# EasyEDA Pro project Esp32TRACK.eprj

# Schematic Schematic1

## Sheets
1 P1: Create Date: 2022-07-31; Page Name: P1; Project Name: Esp32TRACK; Schematic Name: Schematic1; Update Date: 2022-08-05
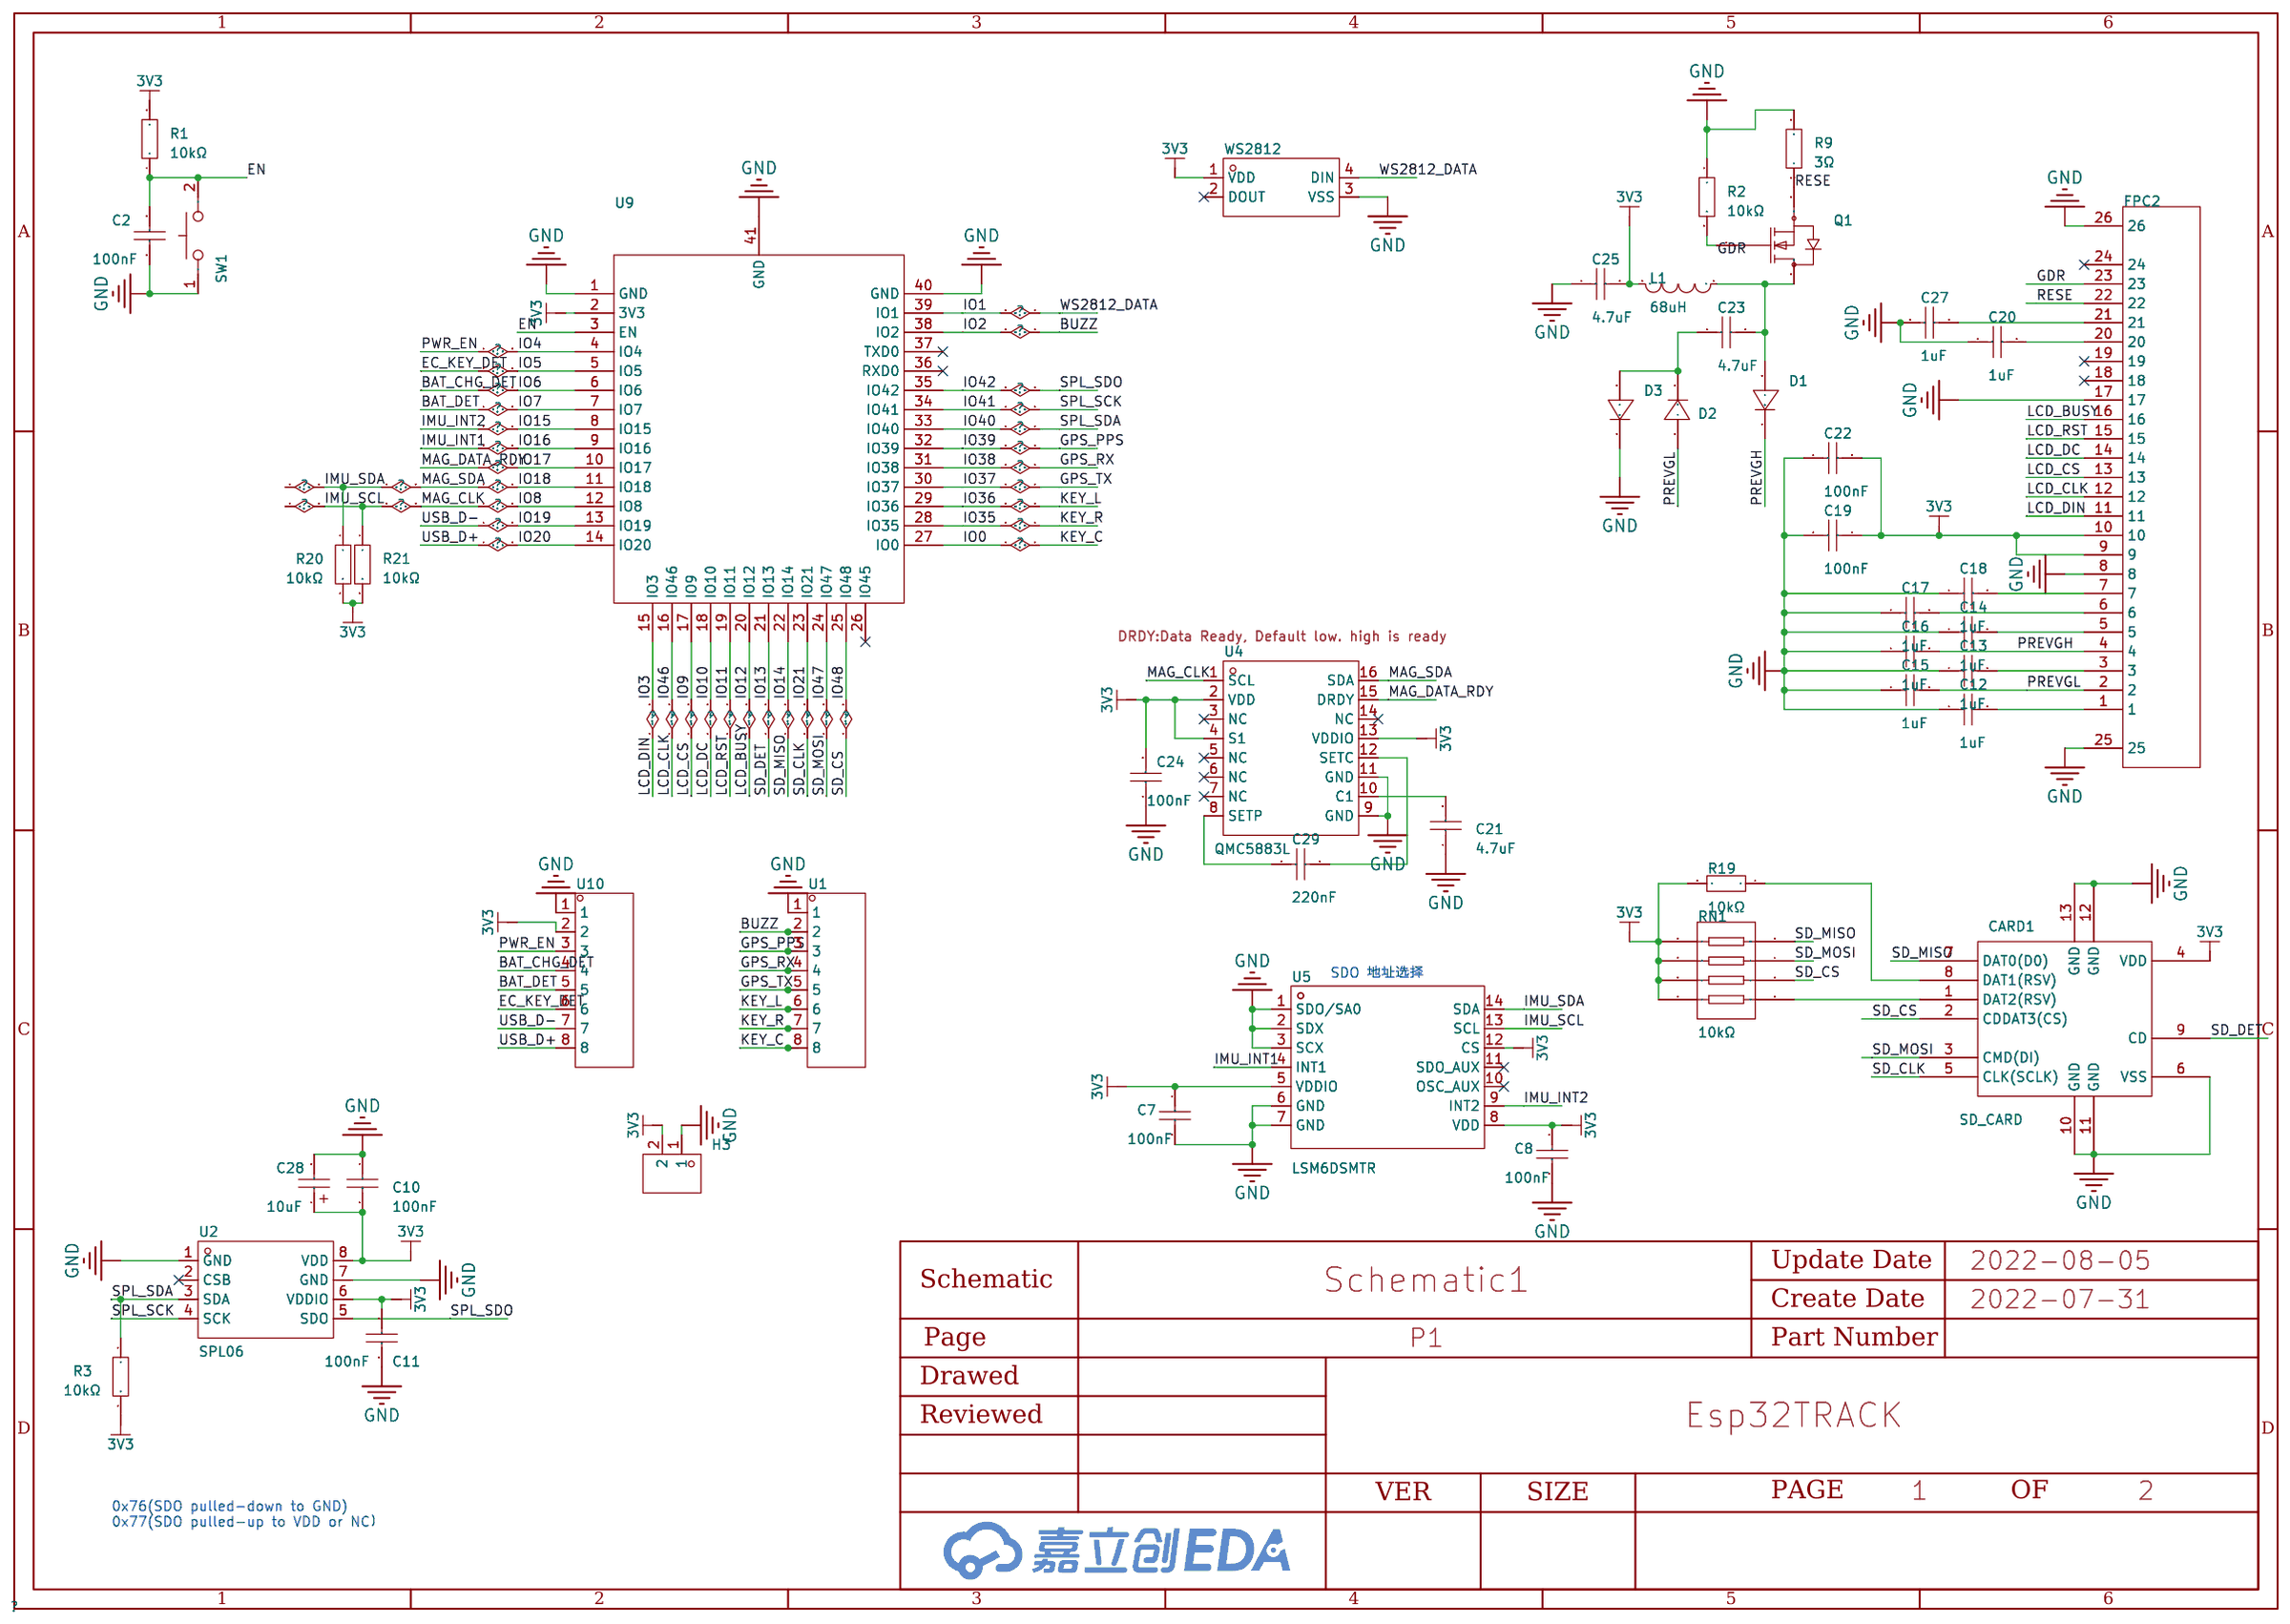
[diagram p0: P1]
2 P2: Create Date: 2022-08-02; Page Name: P2
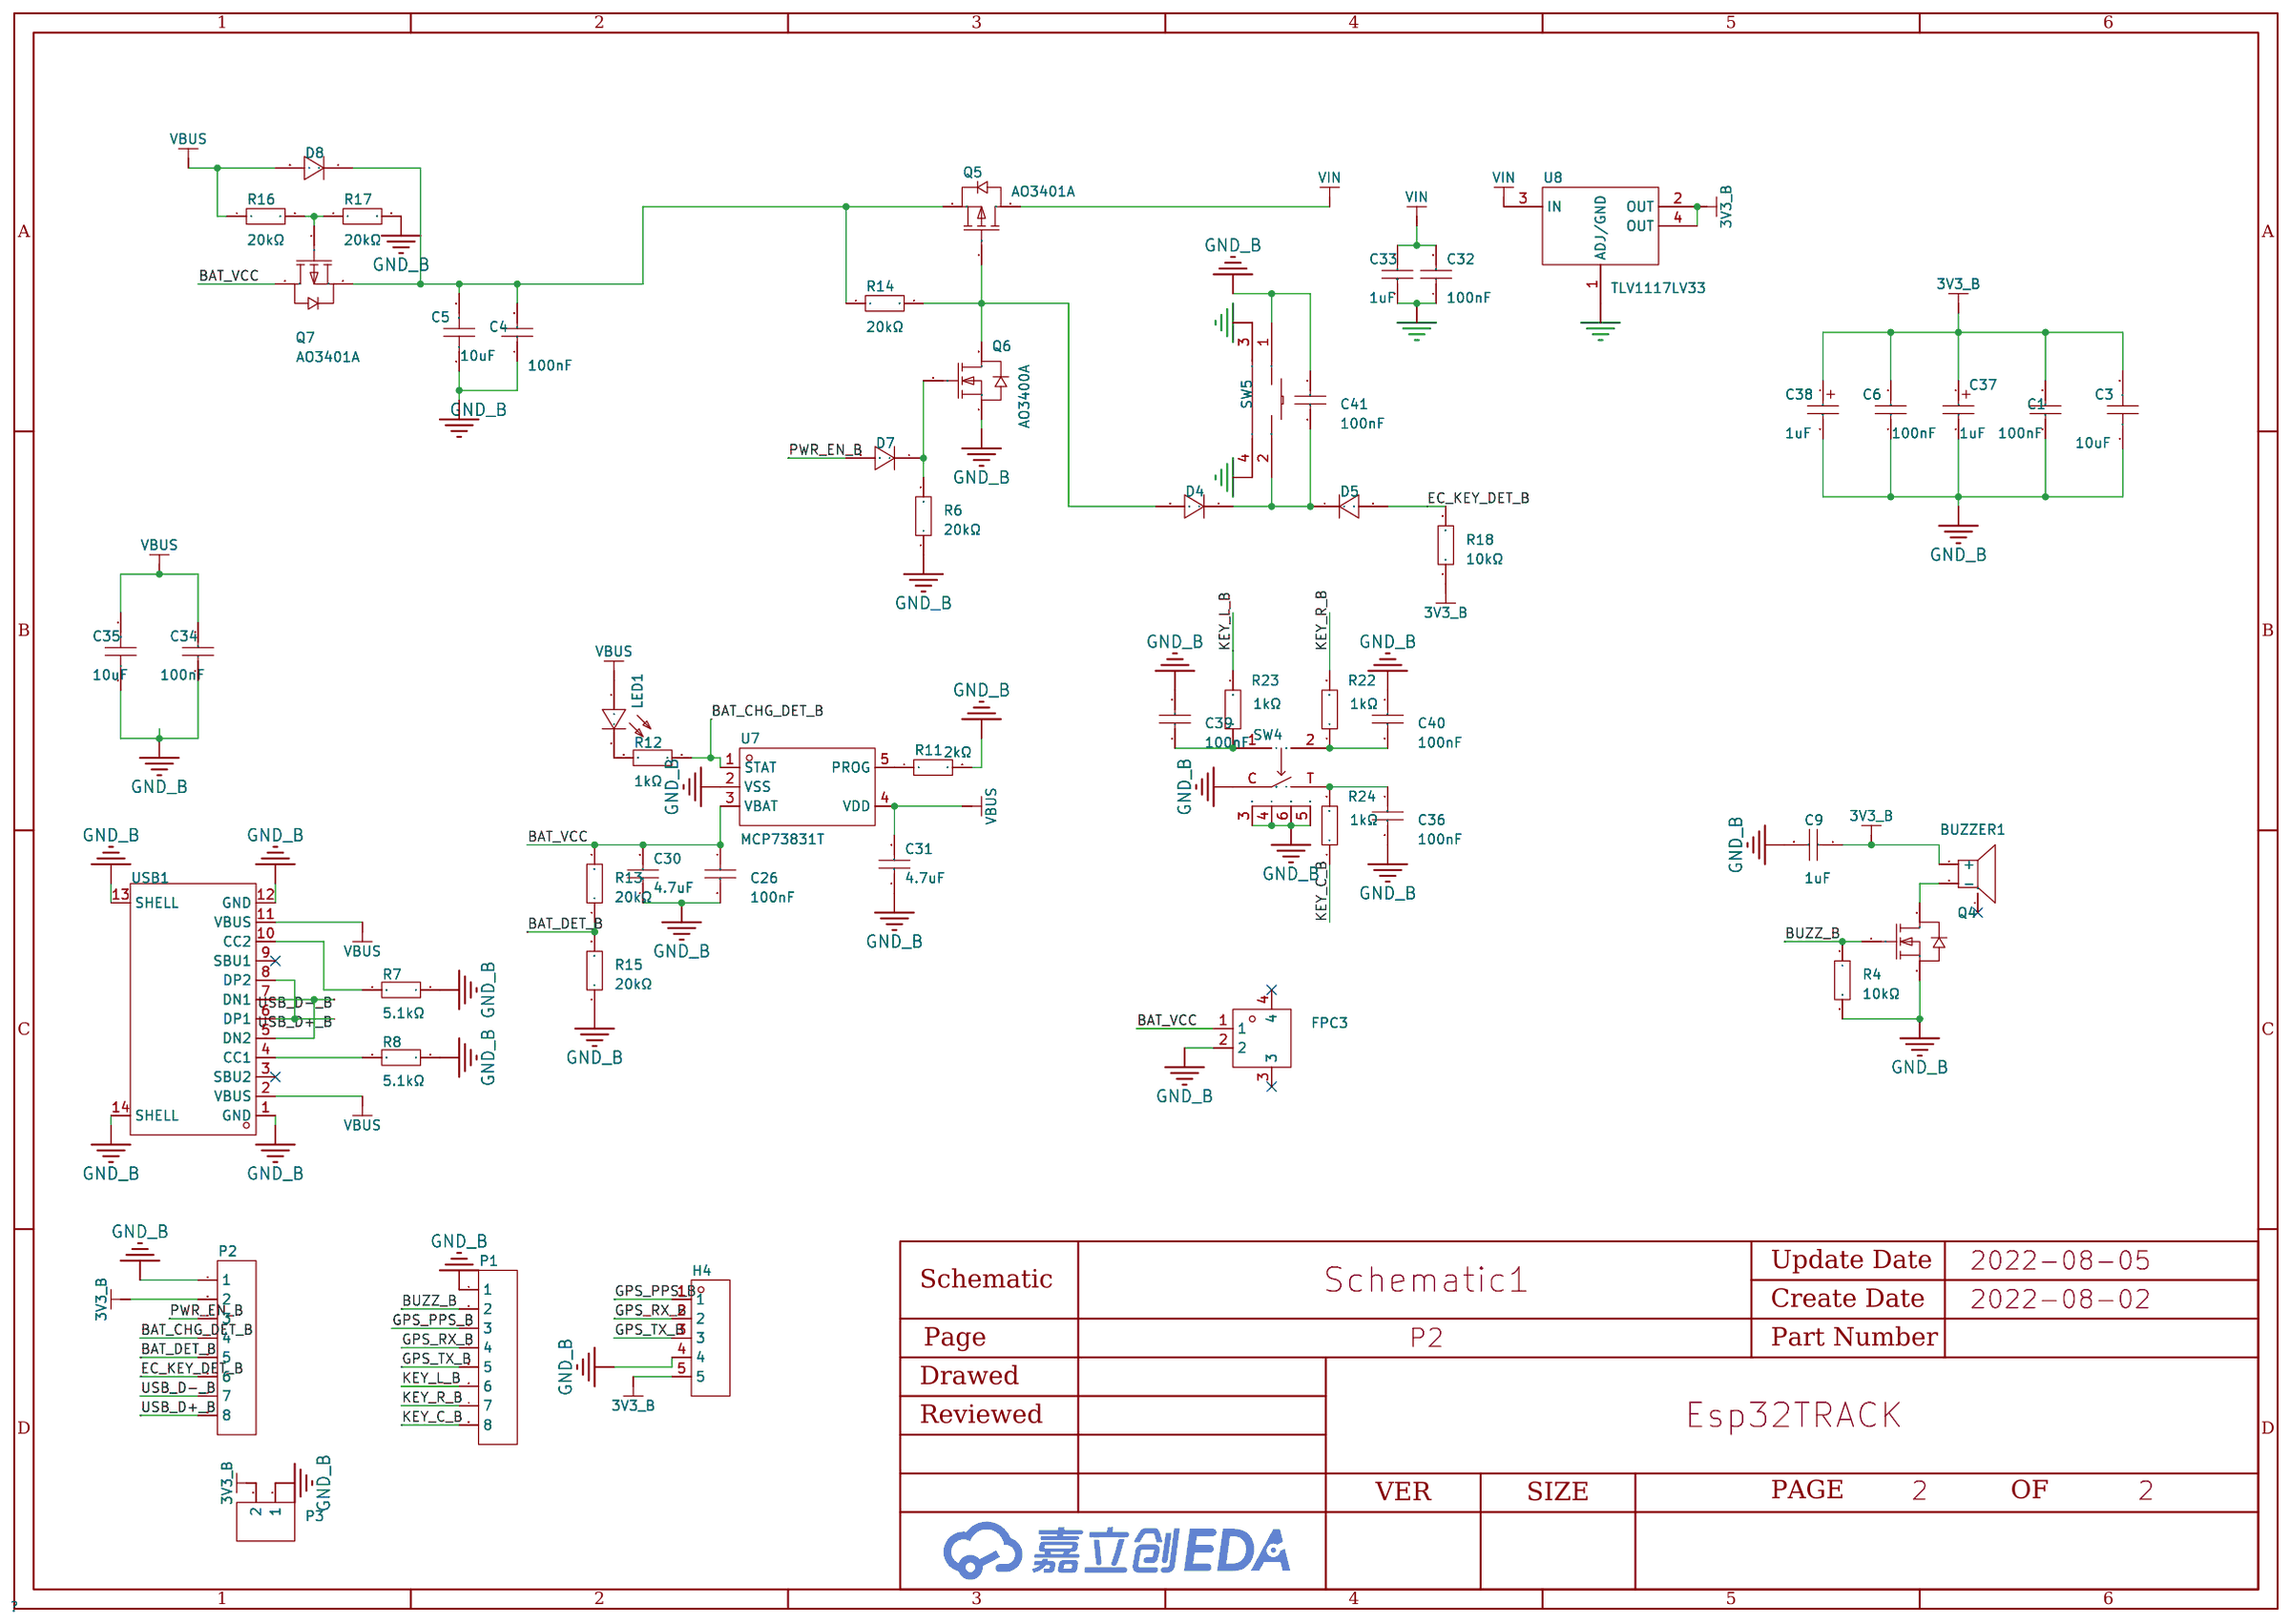
[diagram p1: P2]

## Parts
sheet P1
C2  100nF  [C0603]
C7  100nF  [C0603]
C8  100nF  [C0603]
C10  100nF  [C0603]
C11  100nF  [C0603]
C12  1uF  [C0603]
C13  1uF  [C0603]
C14  1uF  [C0603]
C15  1uF  [C0603]
C16  1uF  [C0603]
C17  1uF  [C0603]
C18  1uF  [C0603]
C19  100nF  [C0603]
C20  1uF  [C0603]
C21  4.7uF  [C0603]
C22  100nF  [C0603]
C23  4.7uF  [C0603]
C24  100nF  [C0603]
C25  4.7uF  [C0603]
C27  1uF  [C0603]
C28  10uF  [CAP-SMD_L3.2-W1.6-RD-C7171]
C29  220nF  [C0603]
CARD1  SD_CARD  [TF-SMD_TF-01A]
D1  -  [SOD-123_L2.8-W1.8-LS3.7-RD]
D2  -  [SOD-123_L2.8-W1.8-LS3.7-RD]
D3  -  [SOD-123_L2.8-W1.8-LS3.7-RD]
FPC2  -  [FPC-SMD_AFC07-S24ECA-00]
H3  -  [HDR-TH_2P-P2.54-V-M]
L1  68uH  [IND-SMD_L5.0-W5.0-P3.60_SMNR5040]
Q1  -  [SOT-323_L2.0-W1.3-P1.30-LS2.1-BR]
R1  10kΩ  [R0603]
R2  10kΩ  [R0603]
R3  10kΩ  [R0603]
R9  3Ω  [R0603]
R19  10kΩ  [R0603]
R20  10kΩ  [R0603]
R21  10kΩ  [R0603]
RN1  10kΩ  [RES-ARRAY-SMD_0603-8P-L3.2-W1.6-BL]
SW1  -  [KEY-SMD_L3.9-W3.0-LS5.0]
U1  -  [HDR-TH_8P-P2.54-V-M]
U2  SPL06  [SENSOR-SMD_SPL06-001]
U4  QMC5883L  [LGA-16_L3.0-W3.0-P0.50-BL_SQ]
U5  LSM6DSMTR  [LGA-14_L3.0-W2.5-P0.50-TL]
U9  -  [WIRELM-SMD_ESP32-S3-WROOM-1U]
U10  -  [HDR-TH_8P-P2.54-V-M]
WS2812  -  [LED-SMD_4P-L3.5-W3.5-TL_WS2812B]
sheet P2
BUZZER1  4000Hz  [BUZ-SMD_3P-L5.2-W5.2-P3.50-BR]
C1  100nF  [C0603]
C3  10uF  [C0603]
C4  100nF  [C0603]
C5  10uF  [C0603]
C6  100nF  [C0603]
C9  1uF  [C0603]
C26  100nF  [C0603]
C30  4.7uF  [C0603]
C31  4.7uF  [C0603]
C32  100nF  [C0603]
C33  1uF  [C0603]
C34  100nF  [C0603]
C35  10uF  [C0603]
C36  100nF  [C0603]
C37  1uF  [CAP-SMD_L3.2-W1.6-RD]
C38  1uF  [CAP-SMD_L3.2-W1.6-RD]
C39  100nF  [C0603]
C40  100nF  [C0603]
C41  100nF  [C0603]
D4  -  [SOD-123F_L2.7-W1.6-LS3.8-RD]
D5  -  [SOD-123F_L2.7-W1.6-LS3.8-RD]
D7  -  [SOD-123F_L2.7-W1.6-LS3.8-RD]
D8  -  [SOD-123F_L2.7-W1.6-LS3.8-RD]
FPC3  -  [CONN-SMD_2P-P1.25_DEALON_1.25-2PWB]
H4  -  [HDR-TH_5P-P2.54-V-M]
LED1  -  [LED0603-FD]
P1  -  [HDR-TH_8P-P2.54-V-F-1]
P2  -  [HDR-TH_8P-P2.54-V-F-1]
P3  -  [HDR-TH_2P-P2.54-V-F]
Q4  -  [SOT-23-3_L2.9-W1.3-P1.90-LS2.4-BR]
Q5  AO3401A  [SOT-23_L2.9-W1.3-P1.90-LS2.4-BR]
Q6  AO3400A  [SOT-23-3_L2.9-W1.6-P1.90-LS2.8-BR]
Q7  AO3401A  [SOT-23_L2.9-W1.3-P1.90-LS2.4-BR]
R4  10kΩ  [R0603]
R6  20kΩ  [R0603]
R7  5.1kΩ  [R0603]
R8  5.1kΩ  [R0603]
R11  2kΩ  [R0603]
R12  1kΩ  [R0603]
R13  20kΩ  [R0603]
R14  20kΩ  [R0603]
R15  20kΩ  [R0603]
R16  20kΩ  [R0603]
R17  20kΩ  [R0603]
R18  10kΩ  [R0603]
R22  1kΩ  [R0603]
R23  1kΩ  [R0603]
R24  1kΩ  [R0603]
SW4  -  [SW-SMD_TM-2023-1]
SW5  -  [KEY-SMD_K2-1806SA-AXXW-XX]
U7  MCP73831T  [SOT-23-5_L3.0-W1.7-P0.95-LS2.8-BR]
U8  TLV1117LV33  [SOT-223_L6.7-W3.5-P2.30-BR]
USB1  -  [USB-C-SMD_TYPE-C-6PIN-2MD-073]

## Library data of the parts
C1 C2 C4 C6-C8 C10 C11 C19 C22 C24 C26 C32 C34 C36 C39-C41 = 0603B104K500NT: 容值:100nF;精度:±10%;额定电压:50V;温度系数:X7R;; LCSC Part Name: 100nF ±10% 50V; Supplier Part: C30926; Manufacturer: FH(风华); Supplier Footprint: 0603; JLCPCB Part Class: Extended Part; Datasheet: https://atta.szlcsc.com/upload/public/pdf/source/20170923/C30926_1506149436298988724.pdf; Supplier: LCSC; Tolerance: ±10%; Voltage Rated: 50V; Temperature Coefficient: X7R
C12-C18 C20 C27 = CL10A105KB8NNNC: 容值:1uF;精度:±10%;额定电压:50V;温度系数:X5R;; LCSC Part Name: 1uF ±10% 50V; Supplier Part: C15849; Manufacturer: SAMSUNG(三星); Supplier Footprint: 0603; JLCPCB Part Class: Basic Part; Datasheet: https://atta.szlcsc.com/upload/public/pdf/source/20160103/1457707679084.pdf; Supplier: LCSC; Tolerance: ±10%; Voltage Rated: 50V; Temperature Coefficient: X5R
C21 C23 C25 C30 C31 = CL10A475KA8NQNC: 温度系数:X5R;额定电压:25V;精度:±10%;容值:4.7uF;; LCSC Part Name: 4.7uF(475) ±10% 25V; Supplier Part: C69335; Manufacturer: SAMSUNG(三星); Supplier Footprint: 0603; JLCPCB Part Class: Extended Part; Datasheet: https://atta.szlcsc.com/upload/public/pdf/source/20161108/1478586410580.pdf; Supplier: LCSC; Temperature Coefficient: X5R; Voltage Rated: 25V; Tolerance: ±10%
C28 = TAJA106K016RNJ: 容值:10uF;精度:±10%;额定电压:16V;等效串联电阻:3Ω@100kHz;工作温度:-55~+125;; LCSC Part Name: 10uF ±10% 16V; Supplier Part: C7171; Manufacturer: Kyocera AVX; Supplier Footprint: CASE-A_3216; JLCPCB Part Class: Basic Part; Datasheet: https://atta.szlcsc.com/upload/public/pdf/source/20160107/1457707748093.pdf; Supplier: LCSC; Tolerance: ±10%; Rated Voltage: 16V; Equivalent Series Resistance(ESR): 3Ω@100kHz; Operating Temperature: -55~+125
C29 = 0603B224K250NT: 容值:220nF;精度:±10%;额定电压:25V;温度系数:X7R;; LCSC Part Name: 220nF ±10% 25V; Supplier Part: C1606; Manufacturer: FH(风华); Supplier Footprint: 0603; JLCPCB Part Class: Extended Part; Datasheet: https://atta.szlcsc.com/upload/public/pdf/source/20170923/C1606_1506149289977988406.pdf; Supplier: LCSC; Tolerance: ±10%; Voltage Rated: 25V; Temperature Coefficient: X7R
CARD1 = TF-01A: 卡连接方式:自弹式;卡类型:MicroSD卡(TF卡);连接器类型:卡座;本体最大高度:-;触头材质:-;触头镀层:-;工作温度范围:-;焊接温度(最大值):-;; LCSC Part Name: 自弹式 MicroSD卡(TF卡) 卡座; Supplier Part: C91145; Manufacturer: 韩国韩荣; Supplier Footprint: SMD; JLCPCB Part Class: Extended Part; Datasheet: https://atta.szlcsc.com/upload/public/pdf/source/20190322/C91145_63CBD6FB4639A3A3EC6A9721F18AE0FB.pdf; Supplier: LCSC; Card Connection Mode: 自弹式; Card Type: MicroSD卡(TF卡); Connector Type: 卡座
D1-D3 = MBR0530: 二极管配置:-;直流反向耐压(Vr):30V;平均整流电流(Io):500mA;正向压降(Vf):550mV@500mA;反向电流(Ir):-;; LCSC Part Name: 30V 500mA 550mV@500mA; Supplier Part: C77336; Manufacturer: CJ（江苏长电/长晶）; Supplier Footprint: SOD-123; JLCPCB Part Class: Extended Part; Datasheet: https://atta.szlcsc.com/upload/public/pdf/source/20160702/1467448303324.pdf; Supplier: LCSC; Reverse Voltage (Vr): 30V; Average Rectified Current (Io): 500mA; Forward Voltage (Vf@If): 550mV@500mA
FPC2 = AFC07-S24ECA-00: 间距:0.5mm;触点数量:24;锁定特性:抽屉式;安装类型:卧贴;触点类型:上接;; LCSC Part Name: 0.5mm P数:24 抽屉式 上接; Supplier Part: C262643; Manufacturer: JS(钜硕电子); Supplier Footprint: SMD,P=0.5mm; JLCPCB Part Class: Extended Part; Datasheet: https://atta.szlcsc.com/upload/public/pdf/source/20180810/C262643_A165FE49097C78A84A50B150AB79460D.pdf; Supplier: LCSC; Pitch: 0.5mm; Number of Contacts: 24; Locking Feature: 抽屉式; Mounting Type: 卧贴; Contact Type: 上接; Height Above Board: 2mm; FFC, FCB Thickness: 0.3mm
H3 = PZ254V-11-02P: 间距:2.54mm;总PIN位数:2;排数:1;插针结构:-;行距:-;安装类型:直插;圆针/方针:-;额定电流:-;额定电压:-;配合针长度:-;塑高:-;触头材质:黄铜;触头镀层:-;颜色:黑色;; LCSC Part Name: 2.54mm; Supplier Part: C492401; Manufacturer: XFCN(台湾兴飞); Supplier Footprint: 插件,P=2.54mm; JLCPCB Part Class: Extended Part; Datasheet: https://atta.szlcsc.com/upload/public/pdf/source/20200309/C492401_A812433581A9B211A7FFA413ADDFF0E5.pdf; Supplier: LCSC; Pitch: 2.54mm; Number of Pins: 2; Number of Rows: 1; Mounting Type: 直插; Contact Material: 黄铜; Color: 黑色
L1 = SWPA5040S680MT: 精度:±20%;直流电阻(DCR):520mΩ;电感值:68uH;额定电流:800mA;; LCSC Part Name: 68uH ±20%; Supplier Part: C86662; Manufacturer: Sunlord(顺络); Supplier Footprint: SMD; JLCPCB Part Class: Extended Part; Datasheet: https://atta.szlcsc.com/upload/public/pdf/source/20170302/1488422689437.pdf; Supplier: LCSC; Length: 5mm; Tolerance: ±20%; Height: 4mm; Width: 5mm; DC Resistance (DCR): 520mΩ; Rated Current: 800mA
Q1 = SI1308EDL: Supplier Part: C4355112; Manufacturer: VBsemi(台湾微碧); Supplier Footprint: SC70-3; JLCPCB Part Class: Extended Part; Datasheet: https://atta.szlcsc.com/upload/public/pdf/source/20220712/F86E3BB2906D071183C948CFEAB36F2B.pdf; Supplier: LCSC
R1-R4 R18-R21 = RC0603JR-0710KL: 电阻类型:厚膜电阻;阻值:10kΩ;精度:±5%;功率:100mW;温度系数:±100ppm/;最大工作电压:75V;工作温度范围:-55~+125;; LCSC Part Name: 10kΩ ±5% 100mW; Supplier Part: C99198; Manufacturer: YAGEO(国巨); Supplier Footprint: 0603; JLCPCB Part Class: Extended Part; Datasheet: https://atta.szlcsc.com/upload/public/pdf/source/20181223/C99198_917934A193F41F77D9F7D214A8C79116.pdf; Supplier: LCSC; Type: 厚膜电阻; Tolerance: ±5%; Power(Watts): 100mW; Temperature Coefficient: ±100ppm/; Overload Voltage (Max): 75V; Operating Temperature Range: -55~+125
R9 = RM06JTN3R0: 电阻类型:厚膜电阻;阻值:3Ω;精度:±5%;功率:1/10W;温度系数:±400ppm/;最大工作电压:75V;工作温度范围:-55~+155;; LCSC Part Name: 3Ω ±5%; Supplier Part: C167056; Manufacturer: 台湾大毅; Supplier Footprint: 0603; JLCPCB Part Class: Extended Part; Datasheet: https://atta.szlcsc.com/upload/public/pdf/source/20180111/C167056_15156385904981255465.pdf; Supplier: LCSC; Type: 厚膜电阻; Tolerance: ±5%; Power(Watts): 1/10W; Temperature Coefficient: ±400ppm/; Overload Voltage (Max): 75V; Operating Temperature Range: -55~+155
RN1 = YC164-JR-0710KL: 阻值:10kΩ;单个元件功率:62.5mW;电阻器数:4;引脚数:8;; LCSC Part Name: 10kΩ ±5% 0603x4; Supplier Part: C107374; Manufacturer: YAGEO(国巨); Supplier Footprint: 1206; JLCPCB Part Class: Extended Part; Datasheet: https://atta.szlcsc.com/upload/public/pdf/source/20170418/1492506324305.pdf; Supplier: LCSC; Power(Watts): 62.5mW; Number of Resistors: 4; Number of Pins: 8
SW1 = SKRKAEE020: 触点电流:50mA;额定电压(DC):12V;电路结构:单刀单掷;安装方式:立贴;按钮形状:圆形按钮;带灯:-;开关长度:3.9mm;开关宽度:2.9mm;开关高度:2mm;; LCSC Part Name: 3.9*2.9*2，1.57N; Supplier Part: C115357; Manufacturer: ALPSALPINE(阿尔卑斯阿尔派); Supplier Footprint: SMD; JLCPCB Part Class: Extended Part; Datasheet: https://atta.szlcsc.com/upload/public/pdf/source/20170620/1497944814772.pdf; Supplier: LCSC; Contact Current: 50mA; Voltage Rating (DC): 12V; Circuit: 单刀单掷; Mounting Style: 立贴; Actuator Style: 圆形按钮; Switch Length: 3.9mm; Switch Width: 2.9mm; Switch Height: 2mm
U1 U10 = Z-211-0811-0021-001: 间距:2.54mm;总PIN位数:8;排数:1;插针结构:1x8P;行距:-;安装类型:直插;圆针/方针:方针;额定电流:-;额定电压:-;配合针长度:6mm;塑高:2.5mm;端接针长度:3mm;触头材质:黄铜;触头镀层:-;工作温度范围:-25~+105;颜色:黑色;; LCSC Part Name: 2.54mm 1x8P; Supplier Part: C190820; Manufacturer: Nextron(台湾正凌); Supplier Footprint: 插件,P=2.54mm; JLCPCB Part Class: Extended Part; Datasheet: https://atta.szlcsc.com/upload/public/pdf/source/20180525/C190820_686788E98164DB7F14582F9FE3B4A39E.pdf; Supplier: LCSC; Pitch: 2.54mm; Number of Pins: 8; Number of Rows: 1; Pin Structure: 1x8P; Mounting Type: 直插; Circluar Pins/Square Pins: 方针; Length of Mating Pin: 6mm; Insulation Height: 2.5mm; Length of End Connection Pin: 3mm; Contact Material: 黄铜; Operating Temperature Range: -25~+105; Color: 黑色
U2 = SPL06-001: LCSC Part Name: 普通气压传感器; Supplier Part: C2684428; Manufacturer: Goertek(歌尔); Supplier Footprint: SMD,2.5x2.0x0.95mm; JLCPCB Part Class: Extended Part; Datasheet: https://atta.szlcsc.com/upload/public/pdf/source/20210120/C2684428_7EA58BBCA3793458F617124FBE4BF8F1.pdf; Supplier: LCSC
U4 = QMC5883L: DRDY:Data Ready, Default low. high is ready; LCSC Part Name: 三轴磁传感器; Supplier Part: C976032; Manufacturer: QST(上海矽睿); Supplier Footprint: LGA-16(3x3x0.9mm); JLCPCB Part Class: Extended Part; Datasheet: https://atta.szlcsc.com/upload/public/pdf/source/20201217/C976032_5B9A2F3901E175046CBA037B1F18A1F2.pdf; Supplier: LCSC
U5 = LSM6DSMTR: iNEMO惯性模块; Supplier Part: C94048; Manufacturer: ST(意法半导体); Supplier Footprint: LGA-14L; JLCPCB Part Class: Extended Part; Datasheet: https://atta.szlcsc.com/upload/public/pdf/source/20170818/C94048_1503051345473895424.pdf; Supplier: LCSC
U9 = ESP32-S3-WROOM-1U-N8: Supplier Part: C2980297; Manufacturer: ESPRESSIF(乐鑫); Supplier Footprint: 模块; JLCPCB Part Class: Extended Part; Datasheet: https://atta.szlcsc.com/upload/public/pdf/source/20220628/A2AC12B3C87735CAEB7EBE2DBE80936C.pdf; Supplier: LCSC
WS2812 = WS2812B-Mini: 发光颜色:RGB三色;二极管配置:-;透镜颜色:-;主波长:472nm；518nm；622nm;峰值波长:-;色温:-;光通量(25时):-;测试电流:12mA;正向电压(VF):-;发光强度:310mcd；780mcd；215mcd;功率:-;发光角度:-;安装方式:-;工作温度:-;; LCSC Part Name: RGB三色; Supplier Part: C527089; Manufacturer: worldsemi; Supplier Footprint: 3535(mm); JLCPCB Part Class: Extended Part; Datasheet: https://atta.szlcsc.com/upload/public/pdf/source/20190620/C114583_ECCAEB884D1CBA01F5696FFC90F90D84.pdf; Supplier: LCSC; Emitted Color: RGB三色; Dominant Wavelength: 472nm；518nm；622nm; Forward Current: 12mA; Luminous Intensity: 310mcd；780mcd；215mcd
BUZZER1 = MLT-5020: 驱动方式:无源(外部驱动);构造类型:电磁式;频率:4000Hz;长度:5.2mm;宽度:5.2mm;高度:2.5mm;; Supplier Part: C94598; Manufacturer: 华能; Supplier Footprint: SMD; JLCPCB Part Class: Extended Part; Datasheet: https://atta.szlcsc.com/upload/public/pdf/source/20210811/111454390007D221D7259018FB170E62.pdf; Supplier: LCSC; Oscillator Circuit: 无源(外部驱动); Technology Type: 电磁式; Length: 5.2mm; Width: 5.2mm; Height: 2.5mm
C3 C5 C35 = CL10A106MA8NRNC: 容值:10uF;精度:±20%;额定电压:25V;温度系数:X5R;; LCSC Part Name: 10uF ±20% 25V; Supplier Part: C96446; Manufacturer: SAMSUNG(三星); Supplier Footprint: 0603; JLCPCB Part Class: Basic Part; Datasheet: https://atta.szlcsc.com/upload/public/pdf/source/20170325/1490427913016.pdf; Supplier: LCSC; Tolerance: ±20%; Voltage Rated: 25V; Temperature Coefficient: X5R
C9 C33 = CL10A105KA8NNNC: 容值:1uF;精度:±10%;额定电压:25V;温度系数:X5R;; LCSC Part Name: 1uF ±10% 25V; Supplier Part: C5673; Manufacturer: SAMSUNG(三星); Supplier Footprint: 0603; JLCPCB Part Class: Extended Part; Datasheet: https://atta.szlcsc.com/upload/public/pdf/source/20160103/1457707739994.pdf; Supplier: LCSC; Tolerance: ±10%; Voltage Rated: 25V; Temperature Coefficient: X5R
C37 C38 = TAJA105K016RNJ: 容值:1uF;精度:±10%;额定电压:16V;等效串联电阻:-;工作温度:-55~+125;; LCSC Part Name: 1uF ±10% 16V; Supplier Part: C7174; Manufacturer: Kyocera AVX; Supplier Footprint: CASE-A_3216; JLCPCB Part Class: Extended Part; Datasheet: https://atta.szlcsc.com/upload/public/pdf/source/20160107/1457707748219.pdf; Supplier: LCSC; Tolerance: ±10%; Rated Voltage: 16V; Operating Temperature: -55~+125
D4 D5 D7 D8 = 1N4148W: 二极管配置:独立式;功率:400mW;直流反向耐压(Vr):75V;平均整流电流(Io):150mA;正向压降(Vf):1.25V@150mA;反向电流(Ir):1A@75V;反向恢复时间(trr):4ns;工作温度:+150@(Tj);; LCSC Part Name: 75V 150mA 4ns; Supplier Part: C81598; Manufacturer: ST(先科); Supplier Footprint: SOD-123; JLCPCB Part Class: Basic Part; Datasheet: https://atta.szlcsc.com/upload/public/pdf/source/20161024/1477288446905.pdf; Supplier: LCSC; Diode Configuration: 独立式; Power Dissipation: 400mW; Reverse Voltage (Vr): 75V; Average Rectified Current (Io): 150mA; Forward Voltage (Vf@If): 1.25V@150mA; Reverse Leakage Current: 1A@75V; Reverse Recovery Time (trr): 4ns; Operating Temperature: +150@(Tj)
FPC3 = 1.25-2PWB: 参考系列:-;间距:1.25mm;插针结构:1x2P;排数:1;每排PIN数:2;行距:-;公母:公型插针;安装方式:卧贴;额定电流:-;工作温度范围:-40~+85;; LCSC Part Name: 1.25mm 1x2P 卧贴; Supplier Part: C2905009; Manufacturer: DEALON(德艺隆); Supplier Footprint: SMD,P=1.25mm; JLCPCB Part Class: Extended Part; Datasheet: https://atta.szlcsc.com/upload/public/pdf/source/20211025/32B11FCE5054D08D2841E43E3DE676AA.pdf; Supplier: LCSC; Pitch: 1.25mm; Pins Structure: 1x2P; Number of Rows: 1; Number of PINs Per Row: 2; Gender: 公型插针; Mounting Style: 卧贴; Operating Temperature Range: -40~+85
H4 = PZ254V-11-05P: 间距:2.54mm;总PIN位数:5;排数:1;插针结构:1x5P;行距:-;安装类型:直插;圆针/方针:方针;额定电流:-;额定电压:-;配合针长度:6mm;塑高:2.5mm;端接针长度:3mm;触头材质:黄铜;触头镀层:-;工作温度范围:-40~+105;颜色:黑色;; LCSC Part Name: 2.54mm 1x5P 直插 方针; Supplier Part: C492404; Manufacturer: XFCN(兴飞); Supplier Footprint: 直插,P=2.54mm; JLCPCB Part Class: Extended Part; Datasheet: https://atta.szlcsc.com/upload/public/pdf/source/20200309/C492404_E51533260F8710EFF5D4617281164C1D.pdf; Supplier: LCSC; Pitch: 2.54mm; Number of Pins: 5; Number of Rows: 1; Pin Structure: 1x5P; Mounting Type: 直插; Circluar Pins/Square Pins: 方针; Length of Mating Pin: 6mm; Insulation Height: 2.5mm; Length of End Connection Pin: 3mm; Contact Material: 黄铜; Operating Temperature Range: -40~+105; Color: 黑色
LED1 = NCD0603R1: 发光颜色:红灯;; LCSC Part Name: 红灯; Supplier Part: C84263; Manufacturer: 国星光电; Supplier Footprint: 0603; JLCPCB Part Class: Extended Part; Datasheet: https://atta.szlcsc.com/upload/public/pdf/source/20200820/C84263_DABC6A75E58F576973B407FDBA283D60.pdf; Supplier: LCSC; Emitted Color: 红灯
P1 P2 = 2.54-1*8P母环保: 间距:2.54mm;总孔位数:8;排数:1;插孔结构:1x8P;行距:-;安装类型:直插;塑高:-;触头材质:-;触头镀层:-;; LCSC Part Name: 2.54mm; Supplier Part: C27438; Manufacturer: BOOMELE(博穆精密); Supplier Footprint: 插件,P=2.54mm; JLCPCB Part Class: Extended Part; Datasheet: https://atta.szlcsc.com/upload/public/pdf/source/20151109/1457707554453.pdf; Supplier: LCSC; Pitch: 2.54mm; Number of Holes: 8; Number of Rows: 1; Holes Structure: 1x8P; Mounting Type: 直插
P3 = 2.54-1*2P母: 间距:2.54mm;总孔位数:2;排数:1;插孔结构:1x2P;行距:-;安装类型:直插;塑高:-;触头材质:-;触头镀层:-;; LCSC Part Name: 2.54mm; Supplier Part: C49661; Manufacturer: BOOMELE(博穆精密); Supplier Footprint: 插件,P=2.54mm; JLCPCB Part Class: Extended Part; Datasheet: https://atta.szlcsc.com/upload/public/pdf/source/20151109/1457707570988.pdf; Supplier: LCSC; Pitch: 2.54mm; Number of Holes: 2; Number of Rows: 1; Holes Structure: 1x2P; Mounting Type: 直插
Q4 = YJL3400A: 类型:N沟道;漏源电压(Vdss):30V;连续漏极电流(Id):5.6A;功率(Pd):1.2W;导通电阻(RDS(on)@Vgs,Id):27mΩ@10V,5.6A;阈值电压(Vgs(th)@Id):1.5V@250A;; LCSC Part Name: N沟道 30V 5.6A; Supplier Part: C699302; Manufacturer: YANGJIE(扬杰); Supplier Footprint: SOT-23-3L; JLCPCB Part Class: Extended Part; Datasheet: https://atta.szlcsc.com/upload/public/pdf/source/20200709/C699302_C2B88B69139871D2E58BC98BB548FF51.pdf; Supplier: LCSC; Type: N沟道; Drain Source Voltage (Vdss): 30V; Continuous Drain Current (Id): 5.6A; Power Dissipation (Pd): 1.2W; Drain Source On Resistance (RDS(on)@Vgs,Id): 27mΩ@10V,5.6A; Gate Threshold Voltage (Vgs(th)@Id): 1.5V@250A
Q5 Q7 = AO3401A: 类型:P沟道;漏源电压(Vdss):30V;连续漏极电流(Id):4A;功率(Pd):1.4W;导通电阻(RDS(on)@Vgs,Id):44mΩ@10V,4.3A;阈值电压(Vgs(th)@Id):1.3V@250A;; LCSC Part Name: P沟道 30V 4A; Supplier Part: C15127; Manufacturer: AOS; Supplier Footprint: SOT-23-3L; JLCPCB Part Class: Basic Part; Datasheet: https://atta.szlcsc.com/upload/public/pdf/source/20160507/1462613609053.pdf; Supplier: LCSC; Type: P沟道; Drain Source Voltage (Vdss): 30V; Continuous Drain Current (Id): 4A; Power Dissipation (Pd): 1.4W; Drain Source On Resistance (RDS(on)@Vgs,Id): 44mΩ@10V,4.3A; Gate Threshold Voltage (Vgs(th)@Id): 1.3V@250A
Q6 = AO3400A: 类型:N沟道;漏源电压(Vdss):30V;连续漏极电流(Id):5.7A;功率(Pd):1.4W;导通电阻(RDS(on)@Vgs,Id):26.5mΩ@10V,5.7A;阈值电压(Vgs(th)@Id):1.5V@250A;; LCSC Part Name: N沟道 30V 5.7A; Supplier Part: C20917; Manufacturer: AOS; Supplier Footprint: SOT-23-3L; JLCPCB Part Class: Basic Part; Datasheet: https://atta.szlcsc.com/upload/public/pdf/source/20140107/1457706668533.pdf; Supplier: LCSC; Type: N沟道; Drain Source Voltage (Vdss): 30V; Continuous Drain Current (Id): 5.7A; Power Dissipation (Pd): 1.4W; Drain Source On Resistance (RDS(on)@Vgs,Id): 26.5mΩ@10V,5.7A; Gate Threshold Voltage (Vgs(th)@Id): 1.5V@250A
R6 R13-R17 = RC0603FR-0720KL: 电阻类型:厚膜电阻;阻值:20kΩ;精度:±1%;功率:100mW;温度系数:±100ppm/;最大工作电压:75V;工作温度范围:-55~+155;; LCSC Part Name: 20kΩ ±1% 100mW; Supplier Part: C105575; Manufacturer: YAGEO(国巨); Supplier Footprint: 0603; JLCPCB Part Class: Extended Part; Datasheet: https://atta.szlcsc.com/upload/public/pdf/source/20170818/C105575_1503051101353895049.pdf; Supplier: LCSC; Type: 厚膜电阻; Tolerance: ±1%; Power(Watts): 100mW; Temperature Coefficient: ±100ppm/; Overload Voltage (Max): 75V; Operating Temperature Range: -55~+155
R7 R8 = RS-03K5101FT: 精度:±1%;温度系数:±100ppm/;功率:100mW;阻值:5.1kΩ;最大工作电压:50V;工作温度范围:-55~+155;; LCSC Part Name: 5.1KΩ(5101) ±1%; Supplier Part: C156350; Manufacturer: FH(风华); Supplier Footprint: 0603; JLCPCB Part Class: Extended Part; Datasheet: https://atta.szlcsc.com/upload/public/pdf/source/20171221/C156350_15138396756901196077.pdf; Supplier: LCSC; Tolerance: ±1%; Temperature Coefficient: ±100ppm/; Power(Watts): 100mW; Overload Voltage (Max): 50V; Operating Temperature Range: -55~+155
R11 = RC0603FR-072KL: 精度:±1%;阻值:2kΩ;温度系数:±100ppm/;功率:100mW;最大工作电压:75V;工作温度范围:-55~+155;; LCSC Part Name: 2kΩ ±1%; Supplier Part: C105576; Manufacturer: YAGEO(国巨); Supplier Footprint: 0603; JLCPCB Part Class: Extended Part; Datasheet: https://atta.szlcsc.com/upload/public/pdf/source/20170428/1493376739276.pdf; Supplier: LCSC; Tolerance: ±1%; Temperature Coefficient: ±100ppm/; Power(Watts): 100mW; Overload Voltage (Max): 75V; Operating Temperature Range: -55~+155
R12 R22-R24 = RC0603FR-071KL: 精度:±1%;温度系数:±100ppm/;阻值:1kΩ;功率:100mW;最大工作电压:75V;工作温度范围:-55~+155;; LCSC Part Name: 1kΩ ±1%; Supplier Part: C22548; Manufacturer: YAGEO(国巨); Supplier Footprint: 0603; JLCPCB Part Class: Extended Part; Datasheet: https://atta.szlcsc.com/upload/public/pdf/source/20180312/7BD3618A8B6324EA6280B0497A051AB7.pdf; Supplier: LCSC; Tolerance: ±1%; Temperature Coefficient: ±100ppm/; Power(Watts): 100mW; Overload Voltage (Max): 75V; Operating Temperature Range: -55~+155
SW4 = TM-2023: 3挡拨轮开关  音响周边开关 多功能开关上中下按键; LCSC Part Name: 3挡拨轮开关; Supplier Part: C318951; Manufacturer: XKB Connectivity(中国星坤); Supplier Footprint: SMD; JLCPCB Part Class: Extended Part; Datasheet: https://atta.szlcsc.com/upload/public/pdf/source/20211015/4E21B3A9DEF1E687333BA1DF36F89D09.pdf; Supplier: LCSC
SW5 = K2-1806SA-A3DW-04: 触点电流:50mA;额定电压(DC):12V;绝缘电阻:100MΩ;安装方式:卧贴;作用力:180gf@±30gf;机械寿命:100000;工作温度:-25~+85;开关长度:4.8mm;开关宽度:3.55mm;开关高度:1.88mm;; LCSC Part Name: 2x4 小型侧按键 160G; Supplier Part: C2690015; Manufacturer: 韩国韩荣; Supplier Footprint: SMD; JLCPCB Part Class: Extended Part; Datasheet: https://atta.szlcsc.com/upload/public/pdf/source/20201126/C961746_BE85072586CFEF659A466A854D742287.pdf; Supplier: LCSC; Contact Current: 50mA; Voltage Rating (DC): 12V; Insulation Resistance: 100MΩ; Mounting Sytle: 卧贴; Operating Force: 180gf@±30gf; Mechanical Life: 100000; Operating Temperature: -25~+85; Switch Length: 4.8mm; Switch Width: 3.55mm; Switch Height: 1.88mm
U7 = MCP73831T-2ACI/OT: 充电电池的类型:-;电池单元组数:-;最大充电电流:-;充满的电池组电压:-;最大供应电压:-;; Supplier Part: C424093; Manufacturer: MICROCHIP(美国微芯); Supplier Footprint: SOT-23-5; JLCPCB Part Class: Extended Part; Datasheet: https://atta.szlcsc.com/upload/public/pdf/source/20190902/C424093_BB3CBFD6F009A8554318004A07DA97EE.pdf; Supplier: LCSC
U8 = TLV1117LV33DCYR: 输出类型:固定;输出极性:正;输出通道数:1;最大输入电压:5.5V;输出电压:3.3V;压差:1.3V@(800mA);输出电流:1A;电源纹波抑制比(PRSS):75dB@(120Hz);; LCSC Part Name: Vin=5.5V Vout=3.3V 1A 75dB@(120Hz); Supplier Part: C15578; Manufacturer: TI(德州仪器); Supplier Footprint: SOT-223; Datasheet: https://atta.szlcsc.com/upload/public/pdf/source/20140704/1457707105729.pdf; Supplier: LCSC; Output Type: 固定; Output Polarity: 正; Number of Outputs: 1; Maximum Input Voltage: 5.5V; Output Voltage: 3.3V; Dropout Voltage: 1.3V@(800mA); Output Current: 1A; Power Supply Rejection Ratio (PRSS): 75dB@(120Hz)
USB1 = TYPE-C 16PIN 2MD(073): 连接器类型:Type-C;标准:-;公母:母座;触点数量:16;端口数量:1;安装方式:卧贴;额定电流 - 电源:5A;工作温度范围:-25~+85;; LCSC Part Name: Type-C 母座 卧贴 带定位柱 不锈钢外壳 2次模顶; Supplier Part: C2765186; Manufacturer: SHOU HAN(首韩); Supplier Footprint: SMD; JLCPCB Part Class: Extended Part; Datasheet: https://atta.szlcsc.com/upload/public/pdf/source/20211123/39B17C16241EAC15C5E277BDA434118E.pdf; Supplier: LCSC; Connector Type: Type-C; Gender: 母座; Number of Contacts: 16; Number of Ports: 1; Mounting Style: 卧贴; Current Rating - Power (Max): 5A; Operating Temperature Range: -25~+85

## Nets
3V3: C7.1 C8.1 C10.2 C11.1 C19.1 C22.1 C24.2 C25.2 C28.1 CARD1.4(VDD) FPC2.9 FPC2.10 H3.2 L1.2 R1.2 R3.2 R19.2 R20.2 R21.2 RN1.1 RN1.2 RN1.3 RN1.4 U2.6(VDDIO) U2.8(VDD) U4.2(VDD) U4.4(S1) U4.13(VDDIO) U5.5(VDDIO) U5.8(VDD) U5.12(CS) U9.2(3V3) U10.2 WS2812.1(VDD)
3V3_B: BUZZER1.2(+) C1.2 C3.2 C6.2 C9.1 C37.1 C38.1 H4.5 P2.2 P3.2 R18.1 U8.2(OUT) U8.4(OUT)
GND: C2.1 C7.2 C8.2 C10.1 C11.2 C12.1 C13.1 C14.1 C15.1 C16.1 C17.1 C18.1 C19.2 C20.1 C21.1 C22.2 C24.1 C25.1 C27.1 C28.2 CARD1.6(VSS) CARD1.10(GND) CARD1.11(GND) CARD1.12(GND) CARD1.13(GND) D3.1(C) FPC2.8 FPC2.17 FPC2.25 FPC2.26 H3.1 R2.1 R9.2 SW1.1 U1.1 U2.1(GND) U2.7(GND) U4.9(GND) U4.11(GND) U5.1(SDO/SA0) U5.2(SDX) U5.3(SCX) U5.6(GND) U5.7(GND) U9.1(GND) U9.40(GND) U9.41(GND) U10.1 WS2812.3(VSS)
GND_B: C1.1 C3.1 C4.1 C5.1 C6.1 C9.2 C26.2 C30.1 C31.1 C32.1 C33.2 C34.1 C35.1 C36.2 C37.2 C38.2 C39.1 C40.1 C41.1 FPC3.2 H4.4 P1.1 P2.1 P3.1 Q4.2(S) Q6.2(S) R4.2 R6.1 R7.1 R8.1 R11.2 R15.1 R17.2 SW4.3 SW4.4 SW4.5 SW4.6 SW4.C SW5.1 SW5.3 SW5.4 U7.2(VSS) U8.1(ADJ/GND) USB1.1(GND) USB1.12(GND) USB1.13(SHELL) USB1.14(SHELL)
VBUS: C31.2 C34.2 C35.2 D8.2(A) LED1.1(A) R16.1 U7.4(VDD) USB1.2(VBUS) USB1.11(VBUS)
VIN: C32.2 C33.1 Q5.3(D) U8.3(IN)
BAT_CHG_DET: U9.6(IO6) U10.4
BAT_CHG_DET_B: P2.4 R12.1 U7.1(STAT)
BAT_DET: U9.7(IO7) U10.5
BAT_DET_B: P2.5 R13.1 R15.2
BAT_VCC: C26.1 C30.2 FPC3.1 Q7.3(D) R13.2 U7.3(VBAT)
BUZZ: U1.2 U9.38(IO2)
BUZZ_B: P1.2 Q4.1(G) R4.1
EC_KEY_DET: U9.5(IO5) U10.6
EC_KEY_DET_B: D5.2(A) P2.6 R18.2
EN: C2.2 R1.1 SW1.2 U9.3(EN)
GDR: FPC2.23 Q1.1(G) R2.2
GPS_PPS: U1.3 U9.32(IO39)
GPS_PPS_B: H4.1 P1.3
GPS_RX: U1.4 U9.31(IO38)
GPS_RX_B: H4.2 P1.4
GPS_TX: U1.5 U9.30(IO37)
GPS_TX_B: H4.3 P1.5
IMU_INT1: U5.4(INT1) U9.9(IO16)
IMU_INT2: U5.9(INT2) U9.8(IO15)
IMU_SCL: R21.1 U4.1(SCL) U5.13(SCL) U9.12(IO8)
IMU_SDA: R20.1 U4.16(SDA) U5.14(SDA) U9.11(IO18)
IO0: U1.8 U9.27(IO0)
IO1: U9.39(IO1) WS2812.4(DIN)
IO3: FPC2.11 U9.15(IO3)
IO4: U9.4(IO4) U10.3
IO9: FPC2.13 U9.17(IO9)
IO10: FPC2.14 U9.18(IO10)
IO11: FPC2.15 U9.19(IO11)
IO12: FPC2.16 U9.20(IO12)
IO13: CARD1.9(CD) U9.21(IO13)
IO14: CARD1.7(DAT0(D0)) RN1.8 U9.22(IO14)
IO17: U4.15(DRDY) U9.10(IO17)
IO19: U9.13(IO19) U10.7
IO20: U9.14(IO20) U10.8
IO21: CARD1.5(CLK(SCLK)) U9.23(IO21)
IO35: U1.7 U9.28(IO35)
IO36: U1.6 U9.29(IO36)
IO40: R3.1 U2.3(SDA) U9.33(IO40)
IO41: U2.4(SCK) U9.34(IO41)
IO42: U2.5(SDO) U9.35(IO42)
IO46: FPC2.12 U9.16(IO46)
IO47: CARD1.3(CMD(DI)) RN1.7 U9.24(IO47)
IO48: CARD1.2(CDDAT3(CS)) RN1.6 U9.25(IO48)
KEY_C_B: P1.8 R24.1
KEY_L_B: P1.6 R23.2
KEY_R_B: P1.7 R22.2
PREVGH: C16.2 D1.1(C) FPC2.4
PREVGL: C15.2 D2.2(A) FPC2.2
PWR_EN_B: D7.2(A) P2.3
RESE: FPC2.22 Q1.2(S) R9.1
USB_D+_B: P2.8 USB1.6(DP1) USB1.8(DP2)
USB_D-_B: P2.7 USB1.5(DN2) USB1.7(DN1)
$1N11068: CARD1.8(DAT1(RSV)) R19.1
$1N11088: CARD1.1(DAT2(RSV)) RN1.5
$1N15208: C12.2 FPC2.1
$1N15252: C13.2 FPC2.3
$1N15399: C14.2 FPC2.5
$1N16072: C18.2 FPC2.7
$1N16103: C17.2 FPC2.6
$1N18173: C20.2 FPC2.20
$1N18210: C27.2 FPC2.21
$1N21310: C23.2 D1.2(A) L1.1 Q1.3(D)
$1N31026: C23.1 D2.1(C) D3.2(A)
$1N64581: C29.1 U4.8(SETP)
$1N64631: C29.2 U4.12(SETC)
$1N65487: C21.2 U4.10(C1)
$2N577: C4.2 C5.2 D8.1(K) Q5.2(S) Q7.2(S) R14.1
$2N1088: R11.1 U7.5(PROG)
$2N1091: LED1.2(K) R12.2
$2N1913: R7.2 USB1.10(CC2)
$2N1914: R8.2 USB1.4(CC1)
$2N4080: D4.2(A) Q5.1(G) Q6.3(D) R14.2
$2N4943: C41.2 D4.1(K) D5.1(K) SW5.2
$2N5383: D7.1(K) Q6.1(G) R6.2
$2N7967: Q7.1(G) R16.2 R17.1
$2N25957: C36.1 R24.2 SW4.T
$2N25997: C39.2 R23.1 SW4.1
$2N26037: C40.2 R22.1 SW4.2
$2N41653: BUZZER1.3(-) Q4.3(D)

Not connected (* = marked no-connect by the designer): BUZZER1 1(NC)*; FPC2 18* 19* 24*; FPC3 3* 4*; U2 2(CSB)*; U4 3(NC)* 5(NC)* 6(NC)* 7(NC)* 14(NC)*; U5 10(OSC_AUX)* 11(SDO_AUX)*; U9 26(IO45)* 36(RXD0)* 37(TXD0)*; USB1 3(SBU2)* 9(SBU1)*; WS2812 2(DOUT)*

## Notes on the sheets
sheet 1
- SDO 地址选择
- 0x76(SDO pulled-down to GND)
  0x77(SDO pulled-up to VDD or NC）

# Board PCB1
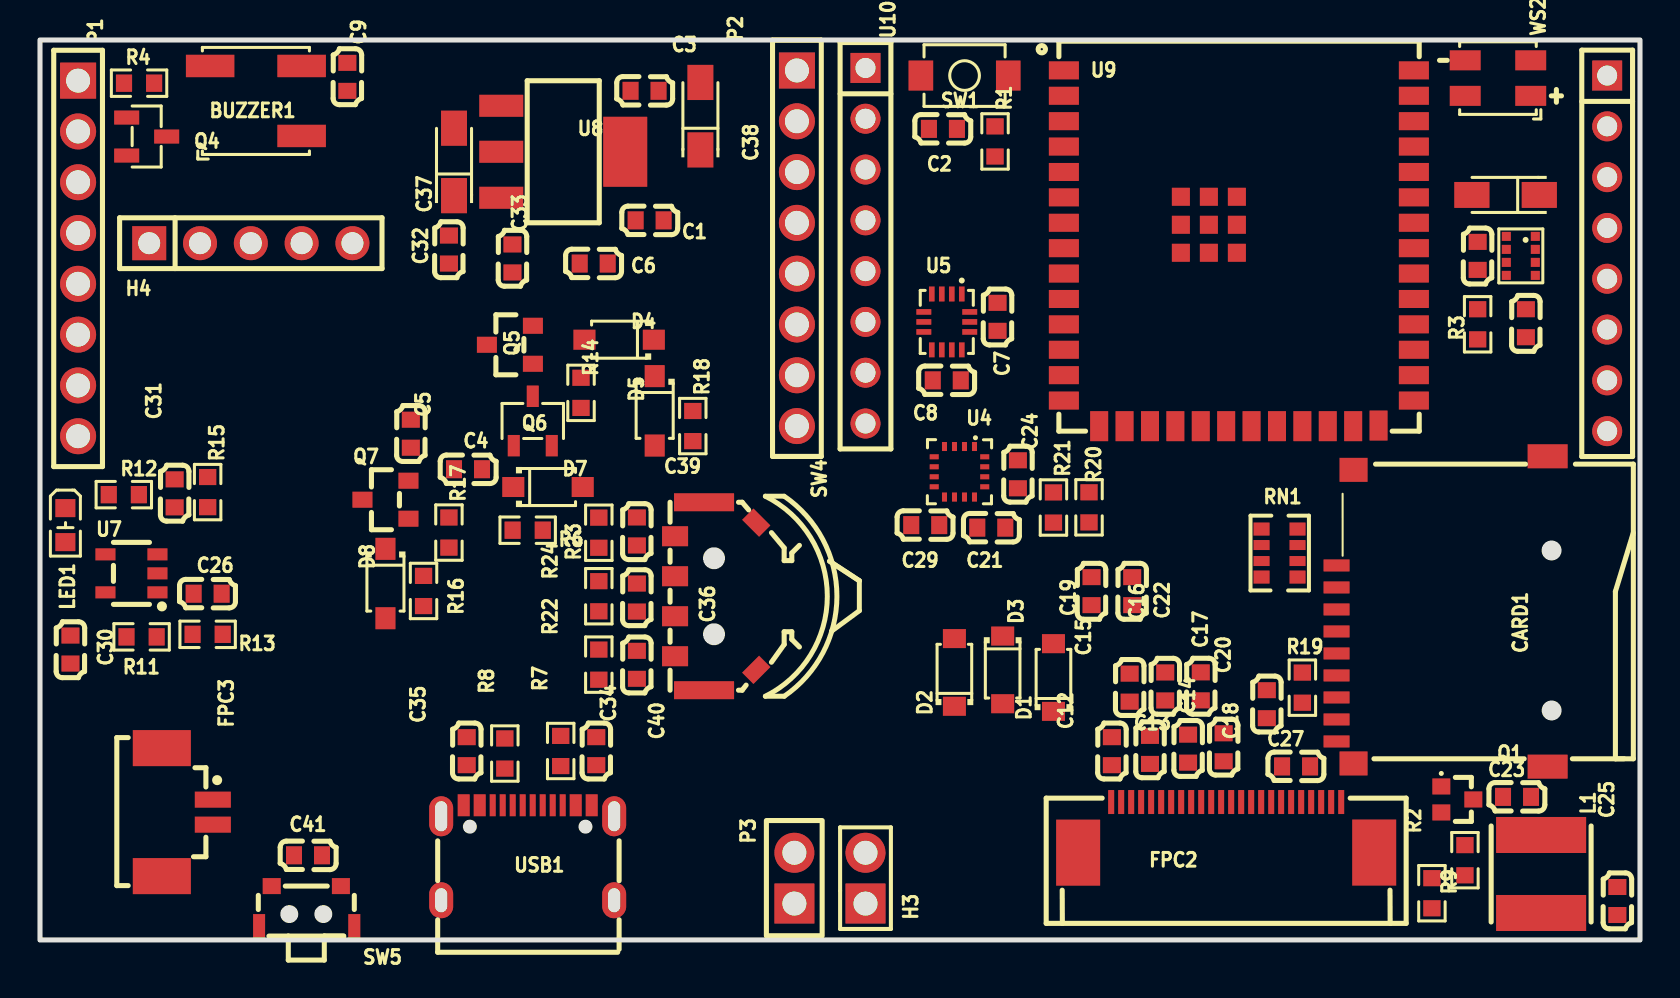
[diagram p2: board, top side]
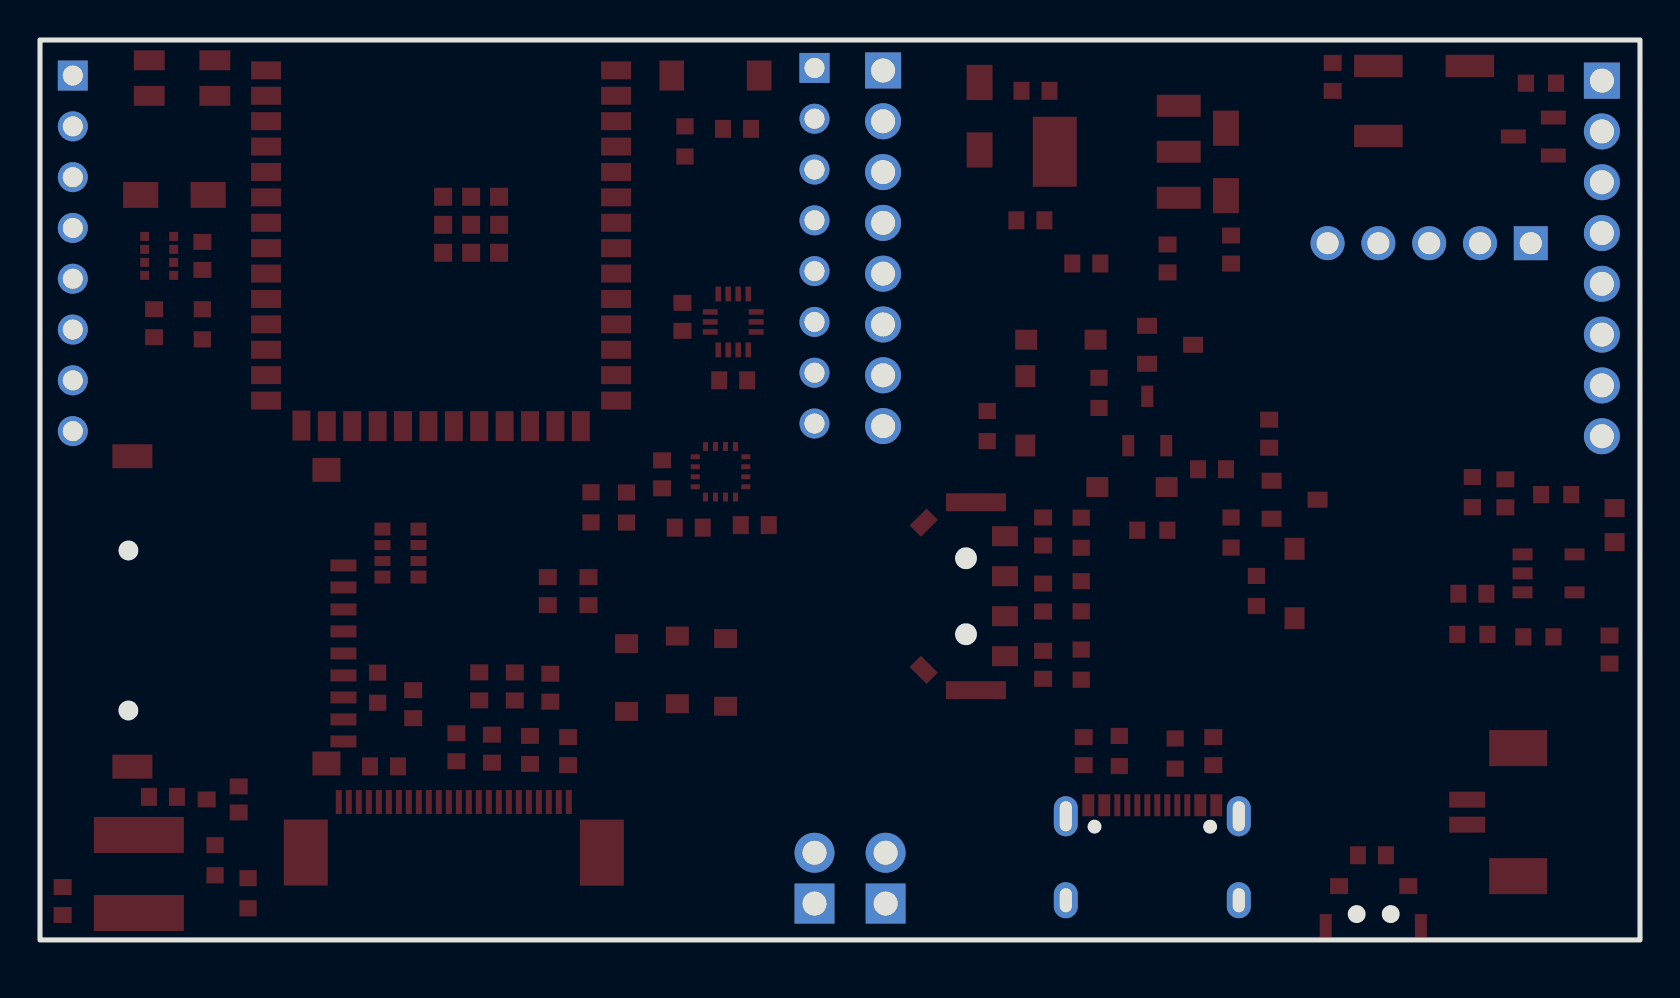
[diagram p3: board, bottom side, seen from below]

Outline 80 x 45 mm; copper layers: Top Layer, Bottom Layer. Coordinates in mm from the lower left corner of the outline.
Outline path: rectangle 0,45 80,0
Stack: Top Layer 0.035mm / Dielectric1 1.51mm FR4 er 4.5 / Bottom Layer 0.035mm

## Design rules (mm)
spacing safeClearance (default): track to track 0.152, other pairs 0.152 to 0.3
track width trackWidth (default): min 0.127, default 0.254, max 2.54
differential pair differentialPair (default): width min 0.127, default 0.254, max 2.54; gap min 0.152, default 0.152
via viaSize (default): diameter min 0.5, default 0.61, max 10; hole min 0.3, default 0.305, max 6

## Placement (name value [footprint] x y rotation side)
BUZZER1  4000Hz  [BUZ-SMD_3P-L5.2-W5.2-P3.50-BR]  10.8 41.95 270 top
C1  100nF  [C0603]  30.48 35.98 180 top
C2  100nF  [C0603]  45.15 40.56 0 top
C3  10uF  [C0603]  30.23 42.46 180 top
C4  100nF  [C0603]  21.4 23.54 180 top
C5  10uF  [C0603]  18.54 25.31 270 top
C6  100nF  [C0603]  27.69 33.82 0 top
C7  100nF  [C0603]  47.88 31.16 90 top
C8  100nF  [C0603]  45.34 27.98 0 top
C9  1uF  [C0603]  15.37 43.16 270 top
C10  100nF  [C0603]  74.29 30.84 90 top
C11  100nF  [C0603]  71.88 34.2 90 top
C12  1uF  [C0603]  53.59 9.44 270 top
C13  1uF  [C0603]  55.5 9.5 270 top
C14  1uF  [C0603]  57.4 9.57 270 top
C15  1uF  [C0603]  54.48 12.61 270 top
C16  1uF  [C0603]  56.26 12.68 270 top
C17  1uF  [C0603]  58.04 12.68 270 top
C18  1uF  [C0603]  59.18 9.64 270 top
C19  100nF  [C0603]  52.58 17.44 90 top
C20  1uF  [C0603]  61.34 11.79 270 top
C21  4.7uF  [C0603]  47.56 20.62 180 top
C22  100nF  [C0603]  54.61 17.44 90 top
C23  4.7uF  [C0603]  73.85 7.15 0 top
C24  100nF  [C0603]  48.9 23.28 270 top
C25  4.7uF  [C0603]  78.87 1.95 270 top
C26  100nF  [C0603]  8.38 17.31 0 top
C27  1uF  [C0603]  62.8 8.68 0 top
C28  10uF  [CAP-SMD_L3.2-W1.6-RD-C7171]  73.28 37.25 180 top
C29  220nF  [C0603]  44.26 20.74 0 top
C30  4.7uF  [C0603]  1.52 14.52 90 top
C31  4.7uF  [C0603]  6.73 22.33 270 top
C32  100nF  [C0603]  20.45 34.52 90 top
C33  1uF  [C0603]  23.62 34.08 270 top
C34  100nF  [C0603]  27.81 9.44 270 top
C35  10uF  [C0603]  21.34 9.44 270 top
C36  100nF  [C0603]  29.84 17.12 90 top
C37  1uF  [CAP-SMD_L3.2-W1.6-RD]  20.7 38.9 90 top
C38  1uF  [CAP-SMD_L3.2-W1.6-RD]  33.02 41.19 90 top
C39  100nF  [C0603]  29.84 20.42 90 top
C40  100nF  [C0603]  29.84 13.76 90 top
C41  100nF  [C0603]  13.4 4.23 180 top
CARD1  SD_CARD  [TF-SMD_TF-01A]  70.1 16.42 90 top
D1  -  [SOD-123_L2.8-W1.8-LS3.7-RD]  50.67 13.12 90 top
D2  -  [SOD-123_L2.8-W1.8-LS3.7-RD]  45.72 13.38 90 top
D3  -  [SOD-123_L2.8-W1.8-LS3.7-RD]  48.13 13.5 270 top
D4  -  [SOD-123F_L2.7-W1.6-LS3.8-RD]  28.96 30.01 180 top
D5  -  [SOD-123F_L2.7-W1.6-LS3.8-RD]  30.73 26.46 270 top
D7  -  [SOD-123F_L2.7-W1.6-LS3.8-RD]  25.4 22.65 0 top
D8  -  [SOD-123F_L2.7-W1.6-LS3.8-RD]  17.27 17.82 270 top
FPC2  -  [FPC-SMD_AFC07-S24ECA-00]  59.31 5.63 0 top
FPC3  -  [CONN-SMD_2P-P1.25_DEALON_1.25-2PWB]  7.37 6.39 270 top
H3  -  [HDR-TH_2P-P2.54-V-M]  41.28 3.09 90 top
H4  -  [HDR-TH_5P-P2.54-V-M]  10.54 34.84 0 top
L1  68uH  [IND-SMD_L5.0-W5.0-P3.60_SMNR5040]  75.06 3.3 270 top
LED1  -  [LED0603-FD]  1.27 20.74 90 top
P1  -  [HDR-TH_8P-P2.54-V-F-1]  1.91 34.08 270 top
P2  -  [HDR-TH_8P-P2.54-V-F-1]  37.85 34.59 270 top
P3  -  [HDR-TH_2P-P2.54-V-F]  37.72 3.09 90 top
Q1  -  [SOT-323_L2.0-W1.3-P1.30-LS2.1-BR]  70.87 7.03 180 top
Q4  -  [SOT-23-3_L2.9-W1.3-P1.90-LS2.4-BR]  5.33 40.17 180 top
Q5  AO3401A  [SOT-23_L2.9-W1.3-P1.90-LS2.4-BR]  23.5 29.76 0 top
Q6  AO3400A  [SOT-23-3_L2.9-W1.6-P1.90-LS2.8-BR]  24.64 25.95 270 top
Q7  AO3401A  [SOT-23_L2.9-W1.3-P1.90-LS2.4-BR]  17.27 22.01 0 top
R1  10kΩ  [R0603]  47.75 39.93 270 top
R2  10kΩ  [R0603]  69.6 2.34 270 top
R3  10kΩ  [R0603]  71.88 30.78 90 top
R4  10kΩ  [R0603]  4.95 42.84 0 top
R6  20kΩ  [R0603]  24.38 20.49 180 top
R7  5.1kΩ  [R0603]  26.03 9.45 270 top
R8  5.1kΩ  [R0603]  23.24 9.32 270 top
R9  3Ω  [R0603]  71.25 3.99 270 top
R11  2kΩ  [R0603]  5.08 15.16 0 top
R12  1kΩ  [R0603]  4.19 22.27 0 top
R13  20kΩ  [R0603]  8.38 15.28 180 top
R14  20kΩ  [R0603]  27.05 27.36 270 top
R15  20kΩ  [R0603]  8.38 22.39 270 top
R16  20kΩ  [R0603]  19.18 17.45 90 top
R17  20kΩ  [R0603]  20.45 20.37 270 top
R18  10kΩ  [R0603]  32.64 25.7 270 top
R19  10kΩ  [R0603]  63.12 12.61 90 top
R20  10kΩ  [R0603]  52.45 21.63 270 top
R21  10kΩ  [R0603]  50.67 21.62 270 top
R22  1kΩ  [R0603]  27.94 13.77 270 top
R23  1kΩ  [R0603]  27.94 20.36 90 top
R24  1kΩ  [R0603]  27.94 17.19 270 top
RN1  10kΩ  [RES-ARRAY-SMD_0603-8P-L3.2-W1.6-BL]  61.98 19.35 270 top
SW1  -  [KEY-SMD_L3.9-W3.0-LS5.0]  46.23 43.22 0 top
SW4  -  [SW-SMD_TM-2023-1]  33.78 17.19 270 top
SW5  -  [KEY-SMD_K2-1806SA-AXXW-XX]  13.33 1.69 180 top
U1  -  [HDR-TH_8P-P2.54-V-M]  78.36 34.33 270 top
U2  SPL06  [SENSOR-SMD_SPL06-001]  74.04 34.2 270 top
U4  QMC5883L  [LGA-16_L3.0-W3.0-P0.50-BL_SQ]  45.97 23.41 180 top
U5  LSM6DSMTR  [LGA-14_L3.0-W2.5-P0.50-TL]  45.34 30.9 270 top
U7  MCP73831T  [SOT-23-5_L3.0-W1.7-P0.95-LS2.8-BR]  4.57 18.33 0 top
U8  TLV1117LV33  [SOT-223_L6.7-W3.5-P2.30-BR]  26.16 39.41 180 top
U9  -  [WIRELM-SMD_ESP32-S3-WROOM-1U]  59.94 34.59 0 top
U10  -  [HDR-TH_8P-P2.54-V-M]  41.28 34.71 270 top
USB1  -  [USB-C-SMD_TYPE-C-6PIN-2MD-073]  24.38 4.36 0 top
WS2812  -  [LED-SMD_4P-L3.5-W3.5-TL_WS2812B]  72.9 43.09 180 top

## Footprints (pads in the part's own frame, mm; a bottom-side part is the same pattern mirrored in y, then rotated)
BUZ-SMD_3P-L5.2-W5.2-P3.50-BR
  rect 1.12x2.425 smd: 1(1.75,2.288) 2(-1.75,2.288) 3(-1.75,-2.288)
C0603
  rect 0.8x0.9 smd: 1(-0.7,0) 2(0.7,0)
CAP-SMD_L3.2-W1.6-RD
  rect 1.758x1.296 smd: 1(-1.687,0) 2(1.687,0)
CAP-SMD_L3.2-W1.6-RD-C7171
  rect 1.758x1.296 smd: 1(-1.687,0) 2(1.687,0)
CONN-SMD_2P-P1.25_DEALON_1.25-2PWB
  rect 0.8x1.801 smd: 1(-0.625,1.275) 2(0.625,1.275)
  rect 1.801x2.901 smd: 3(-3.2,-1.275) 4(3.2,-1.275)
FPC-SMD_AFC07-S24ECA-00
  rect 0.299x1.199 smd: 1(-5.75,1.265) 2(-5.25,1.265) 3(-4.75,1.265) 4(-4.252,1.265) 5(-3.752,1.265) 6(-3.251,1.265) 7(-2.751,1.265) 8(-2.251,1.265) 9(-1.75,1.265) 10(-1.25,1.265) 11(-0.75,1.265) 12(-0.252,1.265) 13(0.249,1.265) 14(0.75,1.265) 15(1.25,1.265) 16(1.75,1.265) 17(2.251,1.265) 18(2.748,1.265) 19(3.248,1.265) 20(3.749,1.265) 21(4.25,1.265) 22(4.75,1.265) 23(5.25,1.265) 24(5.75,1.265)
  rect 2.2x3.3 smd: 25(-7.402,-1.265) 26(7.402,-1.26)
HDR-TH_2P-P2.54-V-F
  rect 1.999x1.999 hole 1.199: 1(-1.27,0)
  round 1.999 hole 1.199: 2(1.27,0)
HDR-TH_2P-P2.54-V-M
  rect 1.999x1.999 hole 1.199: 1(-1.27,0)
  round 1.999 hole 1.199: 2(1.27,0)
HDR-TH_5P-P2.54-V-M
  rect 1.7x1.7 hole 1.1: 1(-5.08,0)
  round 1.7 hole 1.1: 2(-2.54,0) 3(0,0) 4(2.54,0) 5(5.08,0)
HDR-TH_8P-P2.54-V-F-1
  rect 1.801x1.801 hole 1.199: 1(-8.89,0)
  round 1.801 hole 1.199: 2(-6.35,0) 3(-3.81,0) 4(-1.27,0) 5(1.27,0) 6(3.81,0) 7(6.35,0) 8(8.89,0)
HDR-TH_8P-P2.54-V-M
  rect 1.5x1.5 hole 1: 1(-8.89,0)
  round 1.5 hole 1: 2(-6.35,0) 3(-3.81,0) 4(-1.27,0) 5(1.27,0) 6(3.81,0) 7(6.35,0) 8(8.89,0)
IND-SMD_L5.0-W5.0-P3.60_SMNR5040
  rect 1.801x4.501 smd: 1(-1.95,0) 2(1.95,0)
KEY-SMD_K2-1806SA-AXXW-XX
  rect 0.9x0.8 smd: 1(-1.71,-1) 2(1.75,-1)
  rect 0.6x1.2 smd: 3(-2.38,1) 4(2.38,1)
KEY-SMD_L3.9-W3.0-LS5.0
  rect 1.23x1.501 smd: 1(-2.184,0) 2(2.184,0)
LED0603-FD
  rect 0.9x1 smd: 1(-0.85,0) 2(0.85,0)
LED-SMD_4P-L3.5-W3.5-TL_WS2812B
  rect 1.544x0.998 smd: 1(-1.639,0.889) 2(-1.639,-0.889) 3(1.639,-0.889) 4(1.639,0.889)
LGA-14_L3.0-W2.5-P0.50-TL
  rect 0.745x0.28 smd: 1(-1.397,0.75) 2(-1.397,0.25) 3(-1.397,-0.25) 4(-1.397,-0.75) 8(1.397,-0.75) 9(1.397,-0.25) 10(1.397,0.25) 11(1.397,0.75)
  rect 0.28x0.745 smd: 5(-0.5,-1.147) 6(0,-1.147) 7(0.5,-1.147) 12(0.5,1.147) 13(0,1.147) 14(-0.5,1.147)
LGA-16_L3.0-W3.0-P0.50-BL_SQ
  rect 0.25x0.45 smd: 1(-0.75,-1.263) 2(-0.25,-1.263) 3(0.25,-1.263) 4(0.75,-1.263) 9(0.75,1.263) 10(0.25,1.263) 11(-0.25,1.263) 12(-0.75,1.263)
  rect 0.45x0.25 smd: 5(1.263,-0.75) 6(1.263,-0.25) 7(1.263,0.25) 8(1.263,0.75) 13(-1.263,0.75) 14(-1.263,0.25) 15(-1.263,-0.25) 16(-1.263,-0.75)
R0603
  rect 0.806x0.864 smd: 1(-0.753,0) 2(0.753,0)
RES-ARRAY-SMD_0603-8P-L3.2-W1.6-BL
  rect 0.65x0.8 smd: 1(-1.2,-0.9) 4(1.2,-0.9) 5(1.2,0.9) 8(-1.2,0.9)
  rect 0.5x0.8 smd: 2(-0.4,-0.9) 3(0.4,-0.9) 6(0.4,0.9) 7(-0.4,0.9)
SENSOR-SMD_SPL06-001
  rect 0.45x0.45 smd: 1(0.975,-0.725) 2(0.325,-0.725) 3(-0.325,-0.725) 4(-0.975,-0.725) 5(-0.975,0.725) 6(-0.325,0.725) 7(0.325,0.725) 8(0.975,0.725)
SOD-123_L2.8-W1.8-LS3.7-RD
  rect 0.95x1.15 smd: 1(-1.692,0) 2(1.692,0)
SOD-123F_L2.7-W1.6-LS3.8-RD
  rect 1.1x1 smd: 1(-1.735,0) 2(1.735,0)
SOT-23-3_L2.9-W1.3-P1.90-LS2.4-BR
  rect 1.25x0.7 smd: 1(1,-0.95) 2(1,0.95) 3(-1,0)
SOT-23-3_L2.9-W1.6-P1.90-LS2.8-BR
  rect 1.07x0.6 smd: 1(1.235,-0.95) 2(1.235,0.95) 3(-1.235,0)
SOT-23-5_L3.0-W1.7-P0.95-LS2.8-BR
  rect 1x0.6 smd: 1(1.3,-0.95) 2(1.3,0) 3(1.3,0.95) 4(-1.3,0.95) 5(-1.3,-0.95)
SOT-23_L2.9-W1.3-P1.90-LS2.4-BR
  rect 1x0.8 smd: 1(1.15,-0.95) 2(1.15,0.95) 3(-1.15,0)
SOT-223_L6.7-W3.5-P2.30-BR
  rect 2.2x1.1 smd: 1(3.099,-2.299) 2(3.099,0) 3(3.099,2.301)
  rect 2.2x3.5 smd: 4(-3.099,0)
SOT-323_L2.0-W1.3-P1.30-LS2.1-BR
  rect 0.899x0.8 smd: 1(0.8,-0.65) 2(0.8,0.65) 3(-0.8,0)
SW-SMD_TM-2023-1
  rect 1.001x1.3 smd: 1(-2.999,-2.03) 2(2.999,-2.03) C(-1.001,-2.03) T(1.001,-2.03)
  rect 0.899x2.999 smd: 3(-4.699,-0.579) 4(4.699,-0.579)
  rect 1.199x0.8 smd rot 135: 5(3.68,2.03)
  rect 1.199x0.8 smd rot 45: 6(-3.68,2.03)
TF-SMD_TF-01A
  rect 0.6x1.3 smd: 1(2.3,5.276) 2(1.2,5.276) 3(0.101,5.276) 4(-1,5.276) 5(-2.099,5.276) 6(-3.2,5.276) 7(-4.3,5.276) 8(-5.399,5.276) 9(-6.5,5.276)
  rect 1.2x1.4 smd: 10(-7.599,4.426) 13(7.08,4.426)
  rect 1.2x2 smd: 11(-7.76,-5.276) 12(7.76,-5.276)
USB-C-SMD_TYPE-C-6PIN-2MD-073
  rect 0.6x1.1 smd: 1(-3.2,2.375) 2(-2.4,2.375) 11(2.4,2.375) 12(3.2,2.375)
  rect 0.3x1.1 smd: 3(-1.75,2.375) 4(-1.25,2.375) 5(-0.75,2.375) 6(-0.25,2.375) 7(0.25,2.375) 8(0.75,2.375) 9(1.25,2.375) 10(1.75,2.375)
  oval 1.2x2 hole 0.6x1.5: 13(-4.325,1.825) 14(4.325,1.825)
  oval 1.2x1.8 hole 0.6x1.2: 13(-4.325,-2.375) 14(4.325,-2.375)
WIRELM-SMD_ESP32-S3-WROOM-1U
  rect 1.5x0.9 smd: 1(-8.75,8.895) 2(-8.75,7.625) 3(-8.75,6.355) 4(-8.75,5.085) 5(-8.75,3.815) 6(-8.75,2.545) 7(-8.75,1.275) 8(-8.75,0.005) 9(-8.75,-1.265) 10(-8.75,-2.535) 11(-8.75,-3.805) 12(-8.75,-5.075) 13(-8.75,-6.345) 14(-8.75,-7.615) 27(8.75,-7.615) 28(8.75,-6.345) 29(8.75,-5.075) 30(8.75,-3.805) 31(8.75,-2.535) 32(8.75,-1.265) 33(8.75,0.005) 34(8.75,1.275) 35(8.75,2.545) 36(8.75,3.815) 37(8.75,5.085) 38(8.75,6.355) 39(8.75,7.625) 40(8.75,8.895)
  rect 0.9x1.5 smd: 15(-6.985,-8.895) 16(-5.715,-8.895) 17(-4.445,-8.895) 18(-3.175,-8.895) 19(-1.905,-8.895) 20(-0.635,-8.895) 21(0.635,-8.895) 22(1.905,-8.895) 23(3.175,-8.895) 24(4.445,-8.895) 25(5.715,-8.895) 26(6.985,-8.865)
  rect 0.9x0.9 smd: 41(-2.9,2.575) 41(-2.9,1.175) 41(-2.9,-0.225) 41(-1.5,2.575) 41(-1.5,1.175) 41(-1.5,-0.225) 41(-0.1,2.575) 41(-0.1,1.175) 41(-0.1,-0.225)

## Nets
As in the schematic.

Pads without a net: BUZZER1 1; FPC2 18 19 24; FPC3 3 4; U2 2; U4 3 5 6 7 14; U5 10 11; U9 26 36 37; USB1 3 9; WS2812 2
